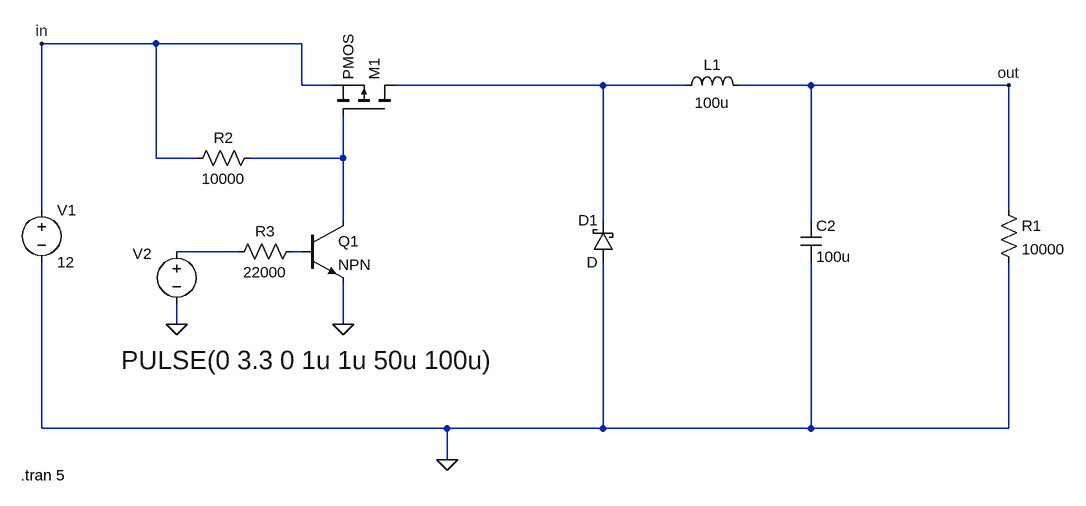
[diagram p0: schematic TraditionalBuckConverter.asc]
TraditionalBuckConverter.asc, the LTspice schematic file:
Version 4
SHEET 1 1556 776
WIRE -160 96 -336 96
WIRE 64 96 -160 96
WIRE 64 160 64 96
WIRE 112 160 64 160
WIRE 528 160 208 160
WIRE 656 160 528 160
WIRE 848 160 736 160
WIRE 1152 160 848 160
WIRE -160 272 -160 96
WIRE -96 272 -160 272
WIRE 128 272 128 208
WIRE 128 272 -16 272
WIRE -336 352 -336 96
WIRE 1152 352 1152 160
WIRE 128 368 128 272
WIRE 528 368 528 160
WIRE 848 368 848 160
WIRE -32 416 -128 416
WIRE 64 416 48 416
WIRE -128 528 -128 496
WIRE 128 528 128 464
WIRE -336 688 -336 432
WIRE 288 688 -336 688
WIRE 528 688 528 432
WIRE 528 688 288 688
WIRE 848 688 848 432
WIRE 848 688 528 688
WIRE 1152 688 1152 432
WIRE 1152 688 848 688
WIRE 288 736 288 688
FLAG 288 736 0
FLAG 128 528 0
FLAG -128 528 0
FLAG 1152 160 out
FLAG -336 96 in
SYMBOL pmos 208 208 M270
SYMATTR InstName M1
SYMBOL ind 640 176 R270
WINDOW 0 32 56 VTop 2
WINDOW 3 5 56 VBottom 2
SYMATTR InstName L1
SYMATTR Value 100u
SYMBOL cap 832 368 R0
SYMATTR InstName C2
SYMATTR Value 100u
SYMBOL res 1136 336 R0
SYMATTR InstName R1
SYMATTR Value 10000
SYMBOL voltage -336 336 R0
SYMATTR InstName V1
SYMATTR Value 12
SYMBOL schottky 544 432 R180
WINDOW 0 24 64 Left 2
WINDOW 3 24 0 Left 2
SYMATTR InstName D1
SYMBOL res 0 256 R90
WINDOW 0 0 56 VBottom 2
WINDOW 3 32 56 VTop 2
SYMATTR InstName R2
SYMATTR Value 10000
SYMBOL npn 64 368 R0
SYMATTR InstName Q1
SYMBOL res -48 432 R270
WINDOW 0 32 56 VTop 2
WINDOW 3 0 56 VBottom 2
SYMATTR InstName R3
SYMATTR Value 22000
SYMBOL voltage -128 400 R0
WINDOW 0 -68 19 Left 2
WINDOW 3 488 183 Right 4
WINDOW 123 0 0 Left 0
WINDOW 39 0 0 Left 0
SYMATTR InstName V2
SYMATTR Value PULSE(0 3.3 0 1u 1u 50u 100u)
TEXT -368 760 Left 2 !.tran 5

The netlist it stands for:
* TraditionalBuckConverter.asc
M1 N001 N002 in in PMOS
L1 N001 out 100u
C2 out 0 100u
R1 out 0 10000
V1 in 0 12
D1 0 N001 D
R2 N002 in 10000
Q1 N002 N004 0 0 NPN
R3 N003 N004 22000
V2 N003 0 PULSE(0 3.3 0 1u 1u 50u 100u)
.model D D
.lib standard.dio
.model NPN NPN
.model PNP PNP
.lib standard.bjt
.model NMOS NMOS
.model PMOS PMOS
.lib standard.mos
.tran 5
.backanno
.end